# Altium schematic sheet 1_Connector.schdoc
size 309 x 223 mm; Symbol: Sheet-Symbol_A4; Device: Sheet-Symbol_A4; Company: EasyEDA.com; Drawed: EasyEDA Pro; Reviewed: EasyEDA Pro; Version: V0.1; Page Size: A4; @Project Name: TUD-EnergyHarvestingConsole_2022-08-29_17-01-09; @Page Count: 5; @Update Date: 2023-01-27; @Create Date: 2023-01-05; @Schematic Name: Schematic2; Part Number: JLCPCB-002; @Page No: 3; @Page Name: Connector
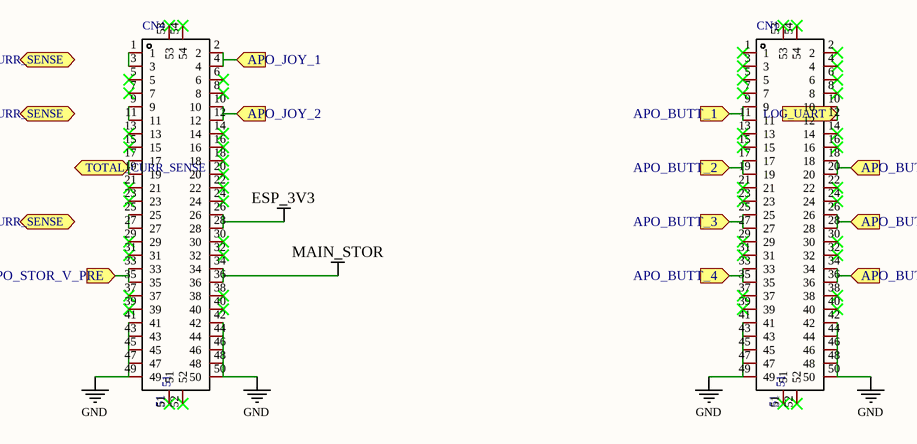
[diagram p0: 1_Connector.schdoc]

## Parts
CN1  NAME: 51  [CONN-SMD_DF40C-50DP-0.4V]  (hidden comment: DF40C-50DP-0.4V(51))
CN4  NAME: 51  [CONN-SMD_DF40C-50DP-0.4V]  (hidden comment: DF40C-50DP-0.4V(51))

## Ports
APO_BUTT_1 (in), APO_BUTT_2 (in), APO_BUTT_3 (in), APO_BUTT_4 (in), APO_BUTT_5 (in), APO_BUTT_6 (in), APO_BUTT_7 (in), APO_JOY_1 (in), APO_JOY_2 (in), APO_STOR_V_PRE (in), CRANK2_CURR_SENSE (bidir), CRANK_CURR_SENSE (bidir), LOG_UART (in), SOLAR_CURR_SENSE (bidir), TOTAL_CURR_SENSE (bidir)

## Nets
ESP_3V3: CN4.26 CN4.28
GND: CN1.41 CN1.42 CN1.43 CN1.44 CN1.45 CN1.46 CN1.47 CN1.48 CN1.49 CN1.50 CN4.41 CN4.42 CN4.43 CN4.44 CN4.45 CN4.46 CN4.47 CN4.48 CN4.49 CN4.50
MAIN_STOR: CN4.34 CN4.36
APO_BUTT_1: CN1.9 CN1.11 ; port APO_BUTT_1
APO_BUTT_2: CN1.17 CN1.19 ; port APO_BUTT_2
APO_BUTT_3: CN1.25 CN1.27 ; port APO_BUTT_3
APO_BUTT_4: CN1.33 CN1.35 ; port APO_BUTT_4
APO_BUTT_5: CN1.34 CN1.36 ; port APO_BUTT_5
APO_BUTT_6: CN1.26 CN1.28 ; port APO_BUTT_6
APO_BUTT_7: CN1.18 CN1.20 ; port APO_BUTT_7
APO_JOY_1: CN4.2 CN4.4 ; port APO_JOY_1
APO_JOY_2: CN4.10 CN4.12 ; port APO_JOY_2
APO_STOR_V_PRE: CN4.33 CN4.35 ; port APO_STOR_V_PRE
LOG_UART: CN1.10 CN1.12 ; port LOG_UART
NetCN4_1: CN4.1 CN4.3
NetCN4_9: CN4.9 CN4.11
NetCN4_17: CN4.17 CN4.19
NetCN4_25: CN4.25 CN4.27

Not connected (* = marked no-connect by the designer): CN1 1* 2* 3* 4* 5* 6* 7* 8* 13* 14* 15* 16* 21* 22* 23* 24* 29* 30* 31* 32* 37* 38* 39* 40* 51* 52* 53* 54*; CN4 5* 6* 7* 8* 13* 14* 15* 16* 18* 20* 21* 22* 23* 24* 29* 30* 31* 32* 37* 38* 39* 40* 51* 52* 53* 54*

## Notes on the sheet
- 1
- 2
- 3
- 4
- 5
- 6
- A
- B
- C
- Schematic
- Schematic2
- Create Date
- Update Date
- 2023-01-27
- 2023-01-05
- Reviewed
- Drawed
- Page
- EasyEDA Pro
- Connector
- Part Number
- TUD-EnergyHarvestingConsole_2022-08-29_17-01-09
- JLCPCB-002
- D
- VER
- SIZE
- PAGE
- OF
- V0.1
- A4
- EasyEDA.com

## Library data of the parts
CN1 CN4 = DF40C-50DP-0.4V(51): Number of Pins:50 Pitch:0.4mm Number of Rows:2 Gender:公 Mounting Style:Brick nogging Current Rating (Max):300mA Operating Temperature Range:-35℃~+85℃ Operating Temperature Range:-35℃~+85℃; Manufacturer: HRS(广濑); Add into BOM: yes; Pitch: 0.4mm; Gender: 公; Current Rating (Max): 300mA; Name: DF40C-50DP-0.4V(51); Symbol: DF40C-50DP-0.4V(51); Device: DF40C-50DP-0.4V(51); LCSC Part Name: BTB板对板,DF40系列,0.4间距,50PIN公座; Supplier Part: C424645; Manufacturer Part: DF40C-50DP-0.4V(51); Supplier Footprint: SMD,P=0.4mm; JLCPCB Part Class: Extended Part; Datasheet: https://atta.szlcsc.com/upload/public/pdf/source/20190903/C424645_15339400A3A97F934F0821F1A6BFE891.pdf; Supplier: LCSC; Convert to PCB: yes; Number of Pins: 50; Number of Rows: 2; Mounting Style: Brick nogging; Operating Temperature Range: -35℃~+85℃; NUMBER: 51